# EAGLE design PFC_breakout_v2a (EAGLE 7.6.0)
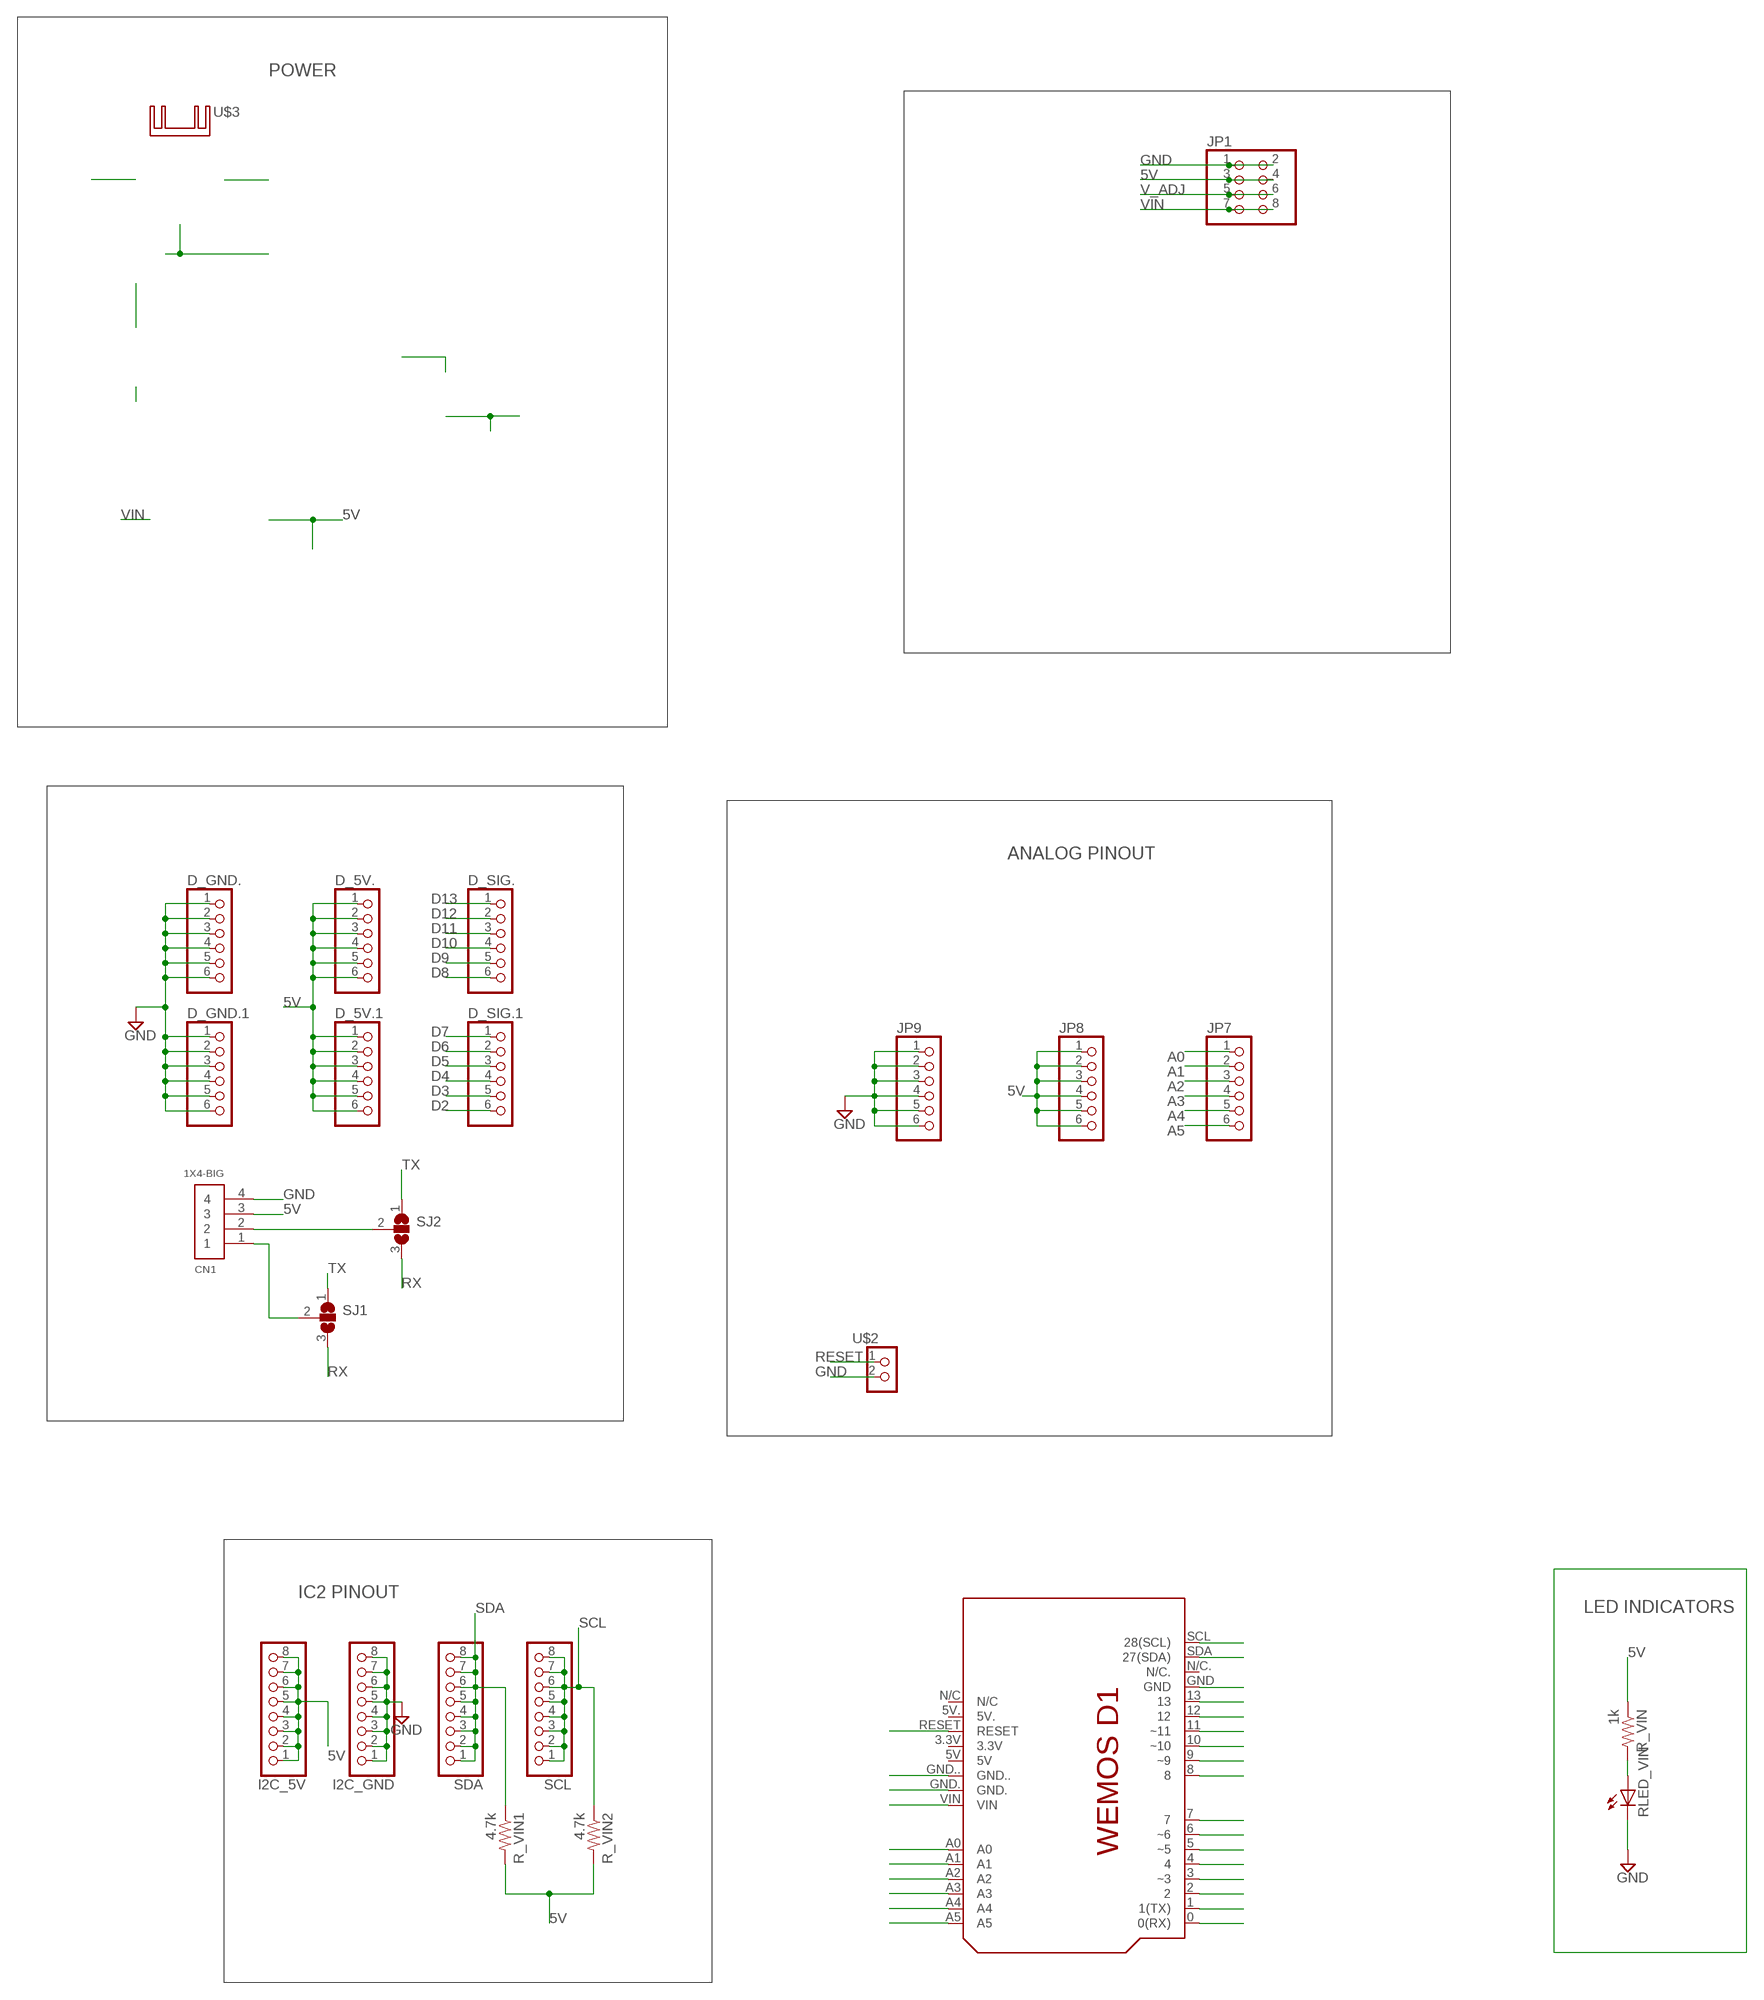
[diagram p0: schematic, sheet 1]

## Parts
CN1  1X4-BIG  [1X04-BIG]
D_5V.  PINHD-1X6  [1X06]
D_5V.1  PINHD-1X6  [1X06]
D_GND.  PINHD-1X6  [1X06]
D_GND.1  PINHD-1X6  [1X06]
D_SIG.  PINHD-1X6  [1X06]
D_SIG.1  PINHD-1X6  [1X06]
I2C_5V  PINHD-1X8CLEANBIG  [1X08-CLEANBIG]
I2C_GND  PINHD-1X8CLEANBIG  [1X08-CLEANBIG]
JP1  PINHD-2X4  [2X04]
JP7  PINHD-1X6  [1X06]
JP8  PINHD-1X6  [1X06]
JP9  PINHD-1X6  [1X06]
R_VIN  1k  R-US_R0603  [R0603]
R_VIN1  4.7k  R-US_R0603  [R0603]
R_VIN2  4.7k  R-US_R0603  [R0603]
RLED_VIN  LEDCHIP-LED0603  [CHIP-LED0603]
SCL  PINHD-1X8CLEANBIG  [1X08-CLEANBIG]
SDA  PINHD-1X8CLEANBIG  [1X08-CLEANBIG]
SJ1  SJ2W  [SJ_2]
SJ2  SJ2W  [SJ_2]
U$1  WEMOS-D1SHIELD  [WEMOS-D1]
U$2  PINHD-2X1  [2X01]
U$3  FW1S  [FW1S-DOCU]

## Nets
5V: CN1.3 D_5V.1.1 D_5V.1.2 D_5V.1.3 D_5V.1.4 D_5V.1.5 D_5V.1.6 D_5V..1 D_5V..2 D_5V..3 D_5V..4 D_5V..5 D_5V..6 I2C_5V.1 I2C_5V.2 I2C_5V.3 I2C_5V.4 I2C_5V.5 I2C_5V.6 I2C_5V.7 I2C_5V.8 JP1.3 JP1.4 JP8.1 JP8.2 JP8.3 JP8.4 JP8.5 JP8.6 R_VIN1.2 R_VIN2.2 R_VIN.1
A0: JP7.1 U$1.A0
A1: JP7.2 U$1.A1
A2: JP7.3 U$1.A2
A3: JP7.4 U$1.A3
A4: JP7.5 U$1.A4
A5: JP7.6 U$1.A5
D2: D_SIG.1.6 U$1.2
D3: D_SIG.1.5 U$1.3(~3)
D4: D_SIG.1.4 U$1.4
D5: D_SIG.1.3 U$1.5(~5)
D6: D_SIG.1.2 U$1.6(~6)
D7: D_SIG.1.1 U$1.7
D8: D_SIG..6 U$1.8
D9: D_SIG..5 U$1.9(~9)
D10: D_SIG..4 U$1.10(~10)
D11: D_SIG..3 U$1.11(~11)
D12: D_SIG..2 U$1.12
D13: D_SIG..1 U$1.13
GND: CN1.4 D_GND.1.1 D_GND.1.2 D_GND.1.3 D_GND.1.4 D_GND.1.5 D_GND.1.6 D_GND..1 D_GND..2 D_GND..3 D_GND..4 D_GND..5 D_GND..6 I2C_GND.1 I2C_GND.2 I2C_GND.3 I2C_GND.4 I2C_GND.5 I2C_GND.6 I2C_GND.7 I2C_GND.8 JP1.1 JP1.2 JP9.1 JP9.2 JP9.3 JP9.4 JP9.5 JP9.6 RLED_VIN.C U$1.GND U$1.GND. U$1.GND.. U$2.2
N$1: R_VIN.2 RLED_VIN.A
N$2: CN1.2 SJ2.2
N$3: CN1.1 SJ1.2
RESET: U$1.RESET U$2.1
RX: SJ1.3 SJ2.3 U$1.0(0(RX))
SCL: R_VIN2.1 SCL.1 SCL.2 SCL.3 SCL.4 SCL.5 SCL.6 SCL.7 SCL.8 U$1.SCL(28(SCL))
SDA: R_VIN1.1 SDA.1 SDA.2 SDA.3 SDA.4 SDA.5 SDA.6 SDA.7 SDA.8 U$1.SDA(27(SDA))
TX: SJ1.1 SJ2.1 U$1.1(1(TX))
V_ADJ: JP1.5 JP1.6
VIN: JP1.7 JP1.8 U$1.VIN
Unconnected: U$1.3.3V U$1.5V U$1.5V. U$1.N/C U$1.N/C.

## Notes on the sheet
- POWER
- ANALOG PINOUT
- IC2 PINOUT
- LED INDICATORS

## Library data of the parts
CN1 = adafruit:1X4: 4-pin connector
D_5V. D_5V.1 D_GND. D_GND.1 D_SIG. D_SIG.1 JP7-JP9 = adafruit:PINHD-1X6: PIN HEADER
I2C_5V I2C_GND SCL SDA = adafruit:PINHD-1X8: PIN HEADER
JP1 = adafruit:PINHD-2X4: PIN HEADER
R_VIN R_VIN1 R_VIN2 = resistor:R-US_: RESISTOR, American symbol
RLED_VIN = led:LED: LED OSRAM: - CHIPLED LG R971, LG N971, LY N971, LG Q971, LY Q971, LO R971, LY R971 LH N974, LH R974 LS Q976, LO Q976, LY Q976 LO Q996 - Hyper CHIPLED LW Q18S LB Q993, LB Q99A, LB R99A - SideLED LS A670, LO A670, LY A670, LG A670, LP A670 LB A673, LV A673, LT A673, LW A673 LH A674 LY A675 LS A676, LA A676, LO A676, LY A676, LW A676 LS A679, LY A679, LG A679 - Hyper Micro SIDELED® LS Y876, LA Y876, LO Y876, LY Y876 LT Y87S - SmartLED LW L88C, LW L88S LB L89C, LB L89S, LG L890 LS L89K, LO L89K, LY L89K LS L896, LA L896, LO L896, LY L896 - TOPLED LS T670, LO T670, LY T670, LG T670, LP T670 LSG T670, LSP T670, LSY T670, LOP T670, LYG T670 LG T671, LOG T671, LSG T671 LB T673, LV T673, LT T673, LW T673 LH T674 LS T676, LA T676, LO T676, LY T676, LB T676, LH T676, LSB T676, LW T676 LB T67C, LV T67C, LT T67C, LS T67K, LO T67K, LY T67K, LW E67C LS E67B, LA E67B, LO E67B, LY E67B, LB E67C, LV E67C, LT E67C LW T67C LS T679, LY T679, LG T679 LS T770, LO T770, LY T770, LG T770, LP T770 LB T773, LV T773, LT T773, LW T773 LH T774 LS E675, LA E675, LY E675, LS T675 LS T776, LA T776, LO T776, LY T776, LB T776 LHGB T686 LT T68C, LB T68C - Hyper Mini TOPLED® LB M676 - Mini TOPLED Santana® LG M470 LS M47K, LO M47K, LY M47K Source: http://www.osram.convergy.de LUXEON: - LUMILED® LXK2-PW12-R00, LXK2-PW12-S00, LXK2-PW14-U00, LXK2-PW14-V00 LXK2-PM12-R00, LXK2-PM12-S00, LXK2-PM14-U00 LXK2-PE12-Q00, LXK2-PE12-R00, LXK2-PE12-S00, LXK2-PE14-T00, LXK2-PE14-U00 LXK2-PB12-K00, LXK2-PB12-L00, LXK2-PB12-M00, LXK2-PB14-N00, LXK2-PB14-P00, LXK2-PB14-Q00 LXK2-PR12-L00, LXK2-PR12-M00, LXK2-PR14-Q00, LXK2-PR14-R00 LXK2-PD12-Q00, LXK2-PD12-R00, LXK2-PD12-S00 LXK2-PH12-R00, LXK2-PH12-S00 LXK2-PL12-P00, LXK2-PL12-Q00, LXK2-PL12-R00 Source: www.luxeon.com KINGBRIGHT: KA-3528ASYC Source: www.kingbright.com
SJ1 SJ2 = jumper:SJ2W: SMD solder JUMPER
U$1 = esp8266modules:WEMOS-D1
U$2 = pinhead:PINHD-2X1
U$3 = heatsink:FW1S: Heat Sink for TO220

## Board
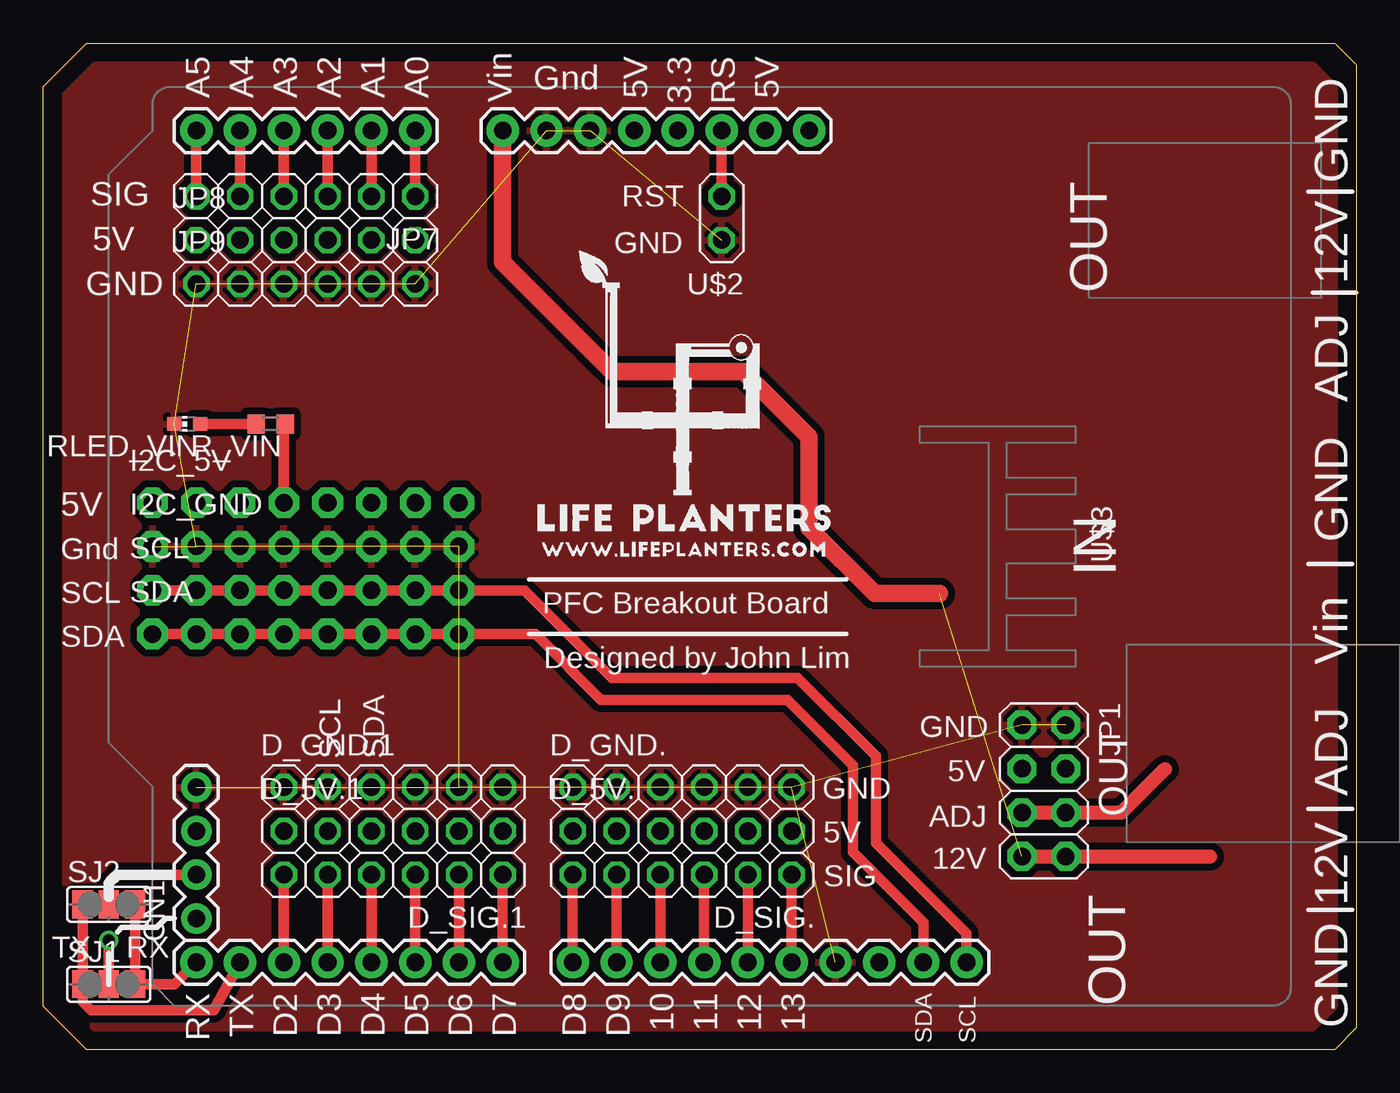
[diagram p1: board, top side]
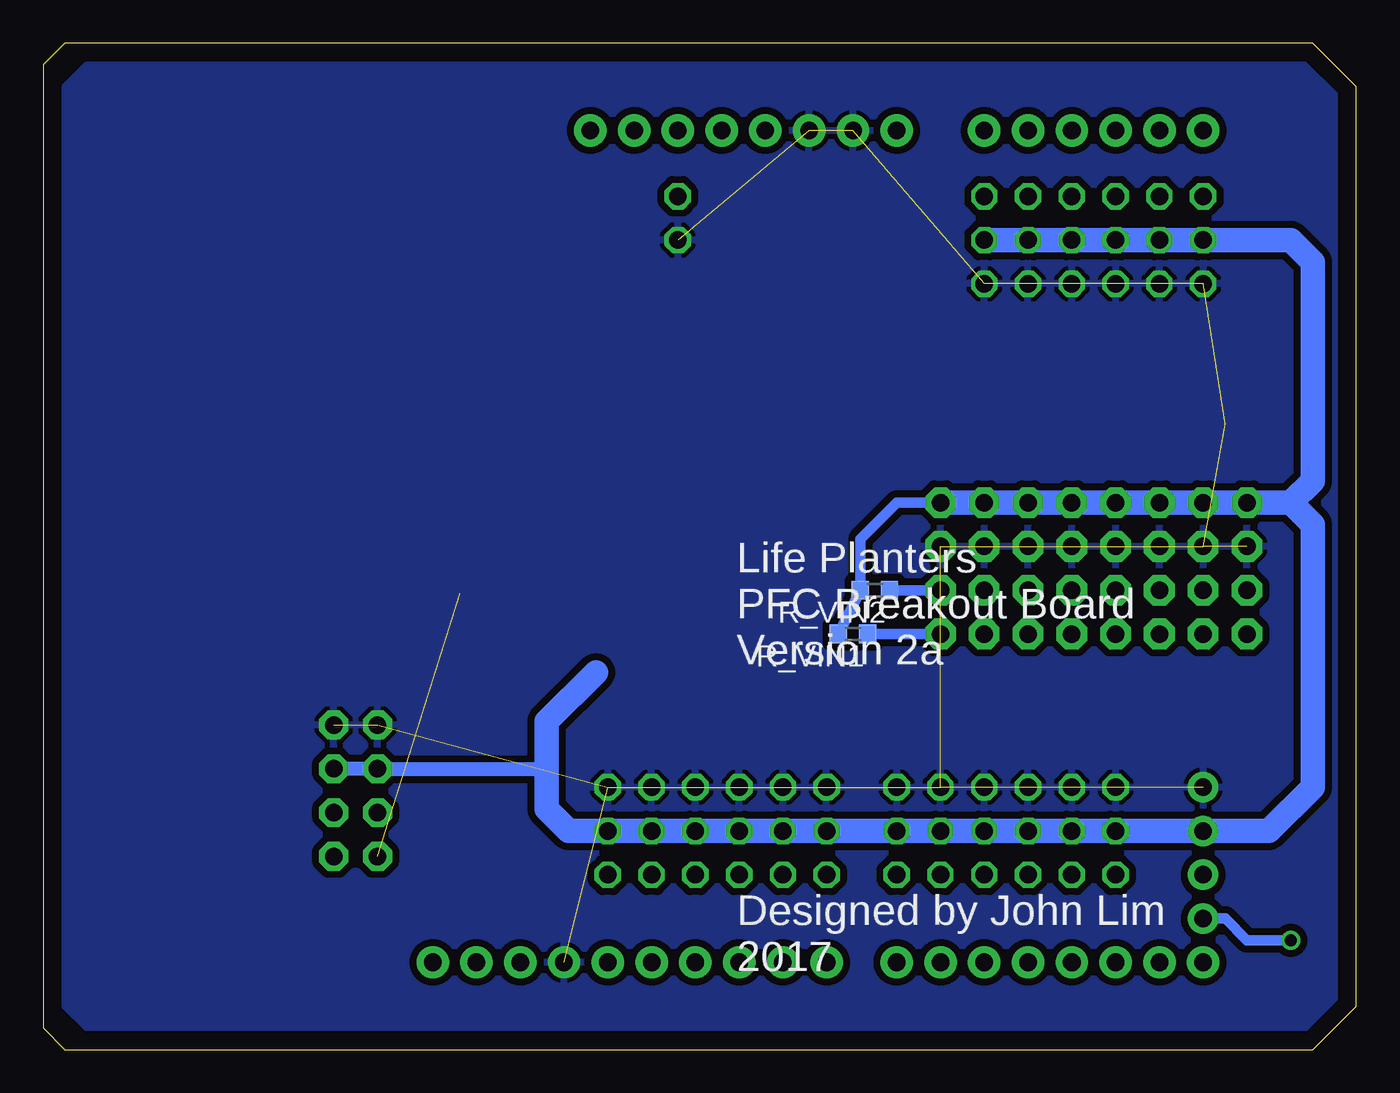
[diagram p2: board, bottom side, seen from below]

Size 76.2 x 58.42 mm. Coordinates in mm from the lower left corner, seen from the top.
Outline: 2.54,58.42 74.93,58.42 76.2,57.15 76.2,1.27 74.93,0 2.54,0 0,2.54 0,55.88 2.54,58.42
Copper layers (1*16): Top 0.035mm / dielectric 1.5mm / Bottom 0.035mm
Design rules "default": minimum track width 10mil, minimum drill 24mil, track to track 8mil, track to pad 8mil, pad to pad 8mil, via to via 8mil, smd to smd 8mil, copper to edge 40mil, drill to drill 8mil, minimum pad ring 10mil, minimum via ring 8mil, stop-mask expansion 4mil, vias tented up to drill 0mil, thermal gap 10mil

### Footprints (pad centres in the part's own frame; a part is rotated, then mirrored left to right if it is on the bottom)
1X04-BIG = drill 1.016 pad 1.778: 1 0,0; 2 2.54,0; 3 5.08,0; 4 7.62,0
1X06 = drill 1.016 octagon: 1 -6.35,0; 2 -3.81,0; 3 -1.27,0; 4 1.27,0; 5 3.81,0; 6 6.35,0
1X08-CLEANBIG = drill 1.016 pad 1.778 octagon: 1 -8.89,0; 2 -6.35,0; 3 -3.81,0; 4 -1.27,0; 5 1.27,0; 6 3.81,0; 7 6.35,0; 8 8.89,0
2X04 = drill 1.016 pad 1.676 octagon: 1 -3.81,-1.27; 2 -3.81,1.27; 3 -1.27,-1.27; 4 -1.27,1.27; 5 1.27,-1.27; 6 1.27,1.27; 7 3.81,-1.27; 8 3.81,1.27
R0603 = smd 1 x 1.1: 1 -0.85,0; 2 0.85,0
CHIP-LED0603 = smd 0.8 x 0.8: A 0,-0.75; C 0,0.75
SJ_2 = smd 1.168 x 1.6: 1 -1.524,0; 2 0,0; 3 1.524,0
WEMOS-D1 = drill 1.016 pad 1.88: 0 63.5,50.8; 1 60.96,50.8; 2 58.42,50.8; 3 55.88,50.8; 3.3V 35.56,2.54; 4 53.34,50.8; 5 50.8,50.8; 5V 38.1,2.54; 5V. 30.48,2.54; 6 48.26,50.8; 7 45.72,50.8; 8 41.656,50.8; 9 39.116,50.8; 10 36.576,50.8; 11 34.036,50.8; 12 31.496,50.8; 13 28.956,50.8; A0 50.8,2.54; A1 53.34,2.54; A2 55.88,2.54; A3 58.42,2.54; A4 60.96,2.54; A5 63.5,2.54; GND 26.416,50.8; GND. 43.18,2.54; GND.. 40.64,2.54; N/C 27.94,2.54; N/C. 23.876,50.8; RESET 33.02,2.54; SCL 18.796,50.8; SDA 21.336,50.8; VIN 45.72,2.54
2X01 = drill 1.016 octagon: 1 -1.27,-1.27; 2 -1.27,1.27

### Placement (x,y rotation side)
CN1  8.89,7.62 90 top
D_5V.  37.08,12.7 0 top
D_5V.1  20.32,12.7 0 top
D_GND.  37.08,15.24 0 top
D_GND.1  20.32,15.24 0 top
D_SIG.  37.08,10.16 180 top
D_SIG.1  20.32,10.16 180 top
I2C_5V  15.24,31.75 0 top
I2C_GND  15.24,29.21 0 top
JP1  58.06,15.04 270 top
JP7  15.24,49.53 180 top
JP8  15.24,46.99 0 top
JP9  15.24,44.45 0 top
R_VIN  13.21,36.32 180 top
R_VIN1  29.21,24.13 180 bottom
R_VIN2  27.94,26.67 180 bottom
RLED_VIN  8.36,36.32 90 top
SCL  15.24,26.67 0 top
SDA  15.24,24.13 0 top
SJ1  3.81,3.81 0 top
SJ2  3.81,8.45 0 top
U$1  72.39,55.88 180 top
U$2  38.1,48.26 180 top
U$3  55.88,29.21 270 top

### Tracks (layer width: path | path; a pad name or v marks a point on that pad's centre or on a via)
5V
  Top 0.61: R_VIN.1 13.97,36.32 I2C_5V.4
  Bottom 0.61: I2C_5V.8 26.67,31.75 28.79,29.63 R_VIN2.2 R_VIN1.2
  Bottom 0.813: 47.19,18.85 46.99,19.05 | 47.19,16.31 JP1.3 JP1.4 | 47.19,16.31 46.99,16.51 | 47.2,16.29 47.19,16.31
  Bottom 1.422: 3.81,31.75 I2C_5V.1 I2C_5V.2 I2C_5V.3 I2C_5V.4 I2C_5V.5 I2C_5V.6 I2C_5V.7 I2C_5V.8 | 3.81,31.75 2.54,30.48 2.54,15.24 5.08,12.7 CN1.3 D_5V.1.1 D_5V.1.2 D_5V.1.3 D_5V.1.4 D_5V.1.5 D_5V.1.6 D_5V..1 D_5V..2 D_5V..3 D_5V..4 D_5V..5 D_5V..6 45.72,12.7 46.99,13.97 46.99,16.51 46.99,19.05 44.13,21.91 | 3.81,31.75 2.54,33.02 2.54,45.72 3.81,46.99 JP8.1 JP8.2 JP8.3 JP8.4 JP8.5 JP8.6
A0
  Top 0.61: U$1.A0 JP7.1
A1
  Top 0.61: U$1.A1 JP7.2
A2
  Top 0.61: U$1.A2 JP7.3
A3
  Top 0.61: U$1.A3 JP7.4
A4
  Top 0.61: U$1.A4 JP7.5
A5
  Top 0.61: U$1.A5 JP7.6
D2
  Top 0.61: D_SIG.1.6 U$1.2
D3
  Top 0.61: D_SIG.1.5 U$1.3
D4
  Top 0.61: D_SIG.1.4 U$1.4
D5
  Top 0.61: D_SIG.1.3 U$1.5
D6
  Top 0.61: D_SIG.1.2 U$1.6
D7
  Top 0.61: D_SIG.1.1 U$1.7
D8
  Top 0.61: U$1.8 D_SIG..6
D9
  Top 0.61: U$1.9 D_SIG..5
D10
  Top 0.61: U$1.10 D_SIG..4
D11
  Top 0.61: U$1.11 D_SIG..3
D12
  Top 0.61: U$1.12 D_SIG..2
D13
  Top 0.61: U$1.13 D_SIG..1
GND  (33 unrouted)
  pour Bottom (isolate 0.406): 1.27,55.88 1.27,2.54 2.54,1.27 73.66,1.27 74.93,2.54 74.93,55.88 73.66,57.15 2.54,57.15
  pour Top (isolate 0.406): 1.27,55.88 1.27,2.54 2.54,1.27 73.66,1.27 74.93,2.54 74.93,55.88 73.66,57.15 2.54,57.15
N$1
  Top 0.61: R_VIN.2 RLED_VIN.A | RLED_VIN.A
N$2
  Top 0.61: SJ2.2 3.81,9.65 4.32,10.16 CN1.2
N$3  (via drill 0.7)
  Top 0.61: SJ1.2 v3.81,6.35
  Bottom 0.61: v3.81,6.35 6.35,6.35 7.62,7.62 CN1.1
RESET
  Top 0.61: U$1.RESET U$2.1
RX
  Top 0.61: U$1.0 7.62,3.81 SJ1.3 SJ2.3
SCL
  Top 0.61: SCL.1 SCL.2 SCL.3 SCL.4 SCL.5 SCL.6 SCL.7 SCL.8 27.94,26.67 33.02,21.59 43.76,21.59 48.31,17.04 48.31,12.01 53.57,6.76 53.57,5.11 U$1.SCL
  Bottom 0.61: R_VIN2.1 SCL.8
SDA
  Top 0.61: SDA.1 SDA.2 SDA.3 SDA.4 SDA.5 SDA.6 SDA.7 SDA.8 28.57,24.13 32.38,20.32 43.18,20.32 46.99,16.51 46.99,11.48 51.08,7.39 51.08,5.11 U$1.SDA
  Bottom 0.61: R_VIN1.1 SDA.8
TX
  Top 0.61: U$1.1 9.91,2.29 2.79,2.29 2.29,2.79 SJ1.1 SJ2.1
V_ADJ
  Top 0.813: JP1.5 JP1.6 62.56,13.77 65.1,16.3
VIN  (1 unrouted)
  Top 0.813: 67.72,11.23 JP1.8 JP1.7
  Top 1.016: U$1.VIN 26.67,45.72 33.02,39.37 40.64,39.37 44.45,35.56 44.45,30.28 48.26,26.47 52.01,26.47

### Text on the board
tPlace: PFC Breakout Board | Designed by John Lim
bPlace: Life Planters / PFC Breakout Board / Version 2a | Designed by John Lim / 2017
tSilk: A5 | A4 | A3 | A2 | A1 | A0 | Vin | 5V | 3.3 | RS | 5V | Gnd | RST | GND | SIG | 5V | GND | 12V | GND | OUT | ADJ | 5V | GND | Gnd | IN | SCL | SDA | Vin | GND | SCL | SDA | 5V | GND | ADJ | OUT | ADJ | 5V | 12V | SIG | 12V | TX | RX | RX | TX | D2 | D3 | D4 | D5 | D6 | D7 | D8 | D9 | 10 | 11 | 12 | 13 | OUT | GND | SDA | SCL